# EAGLE schematic RPiOperant (EAGLE 9.1.3)

## Sheet 1 of 2
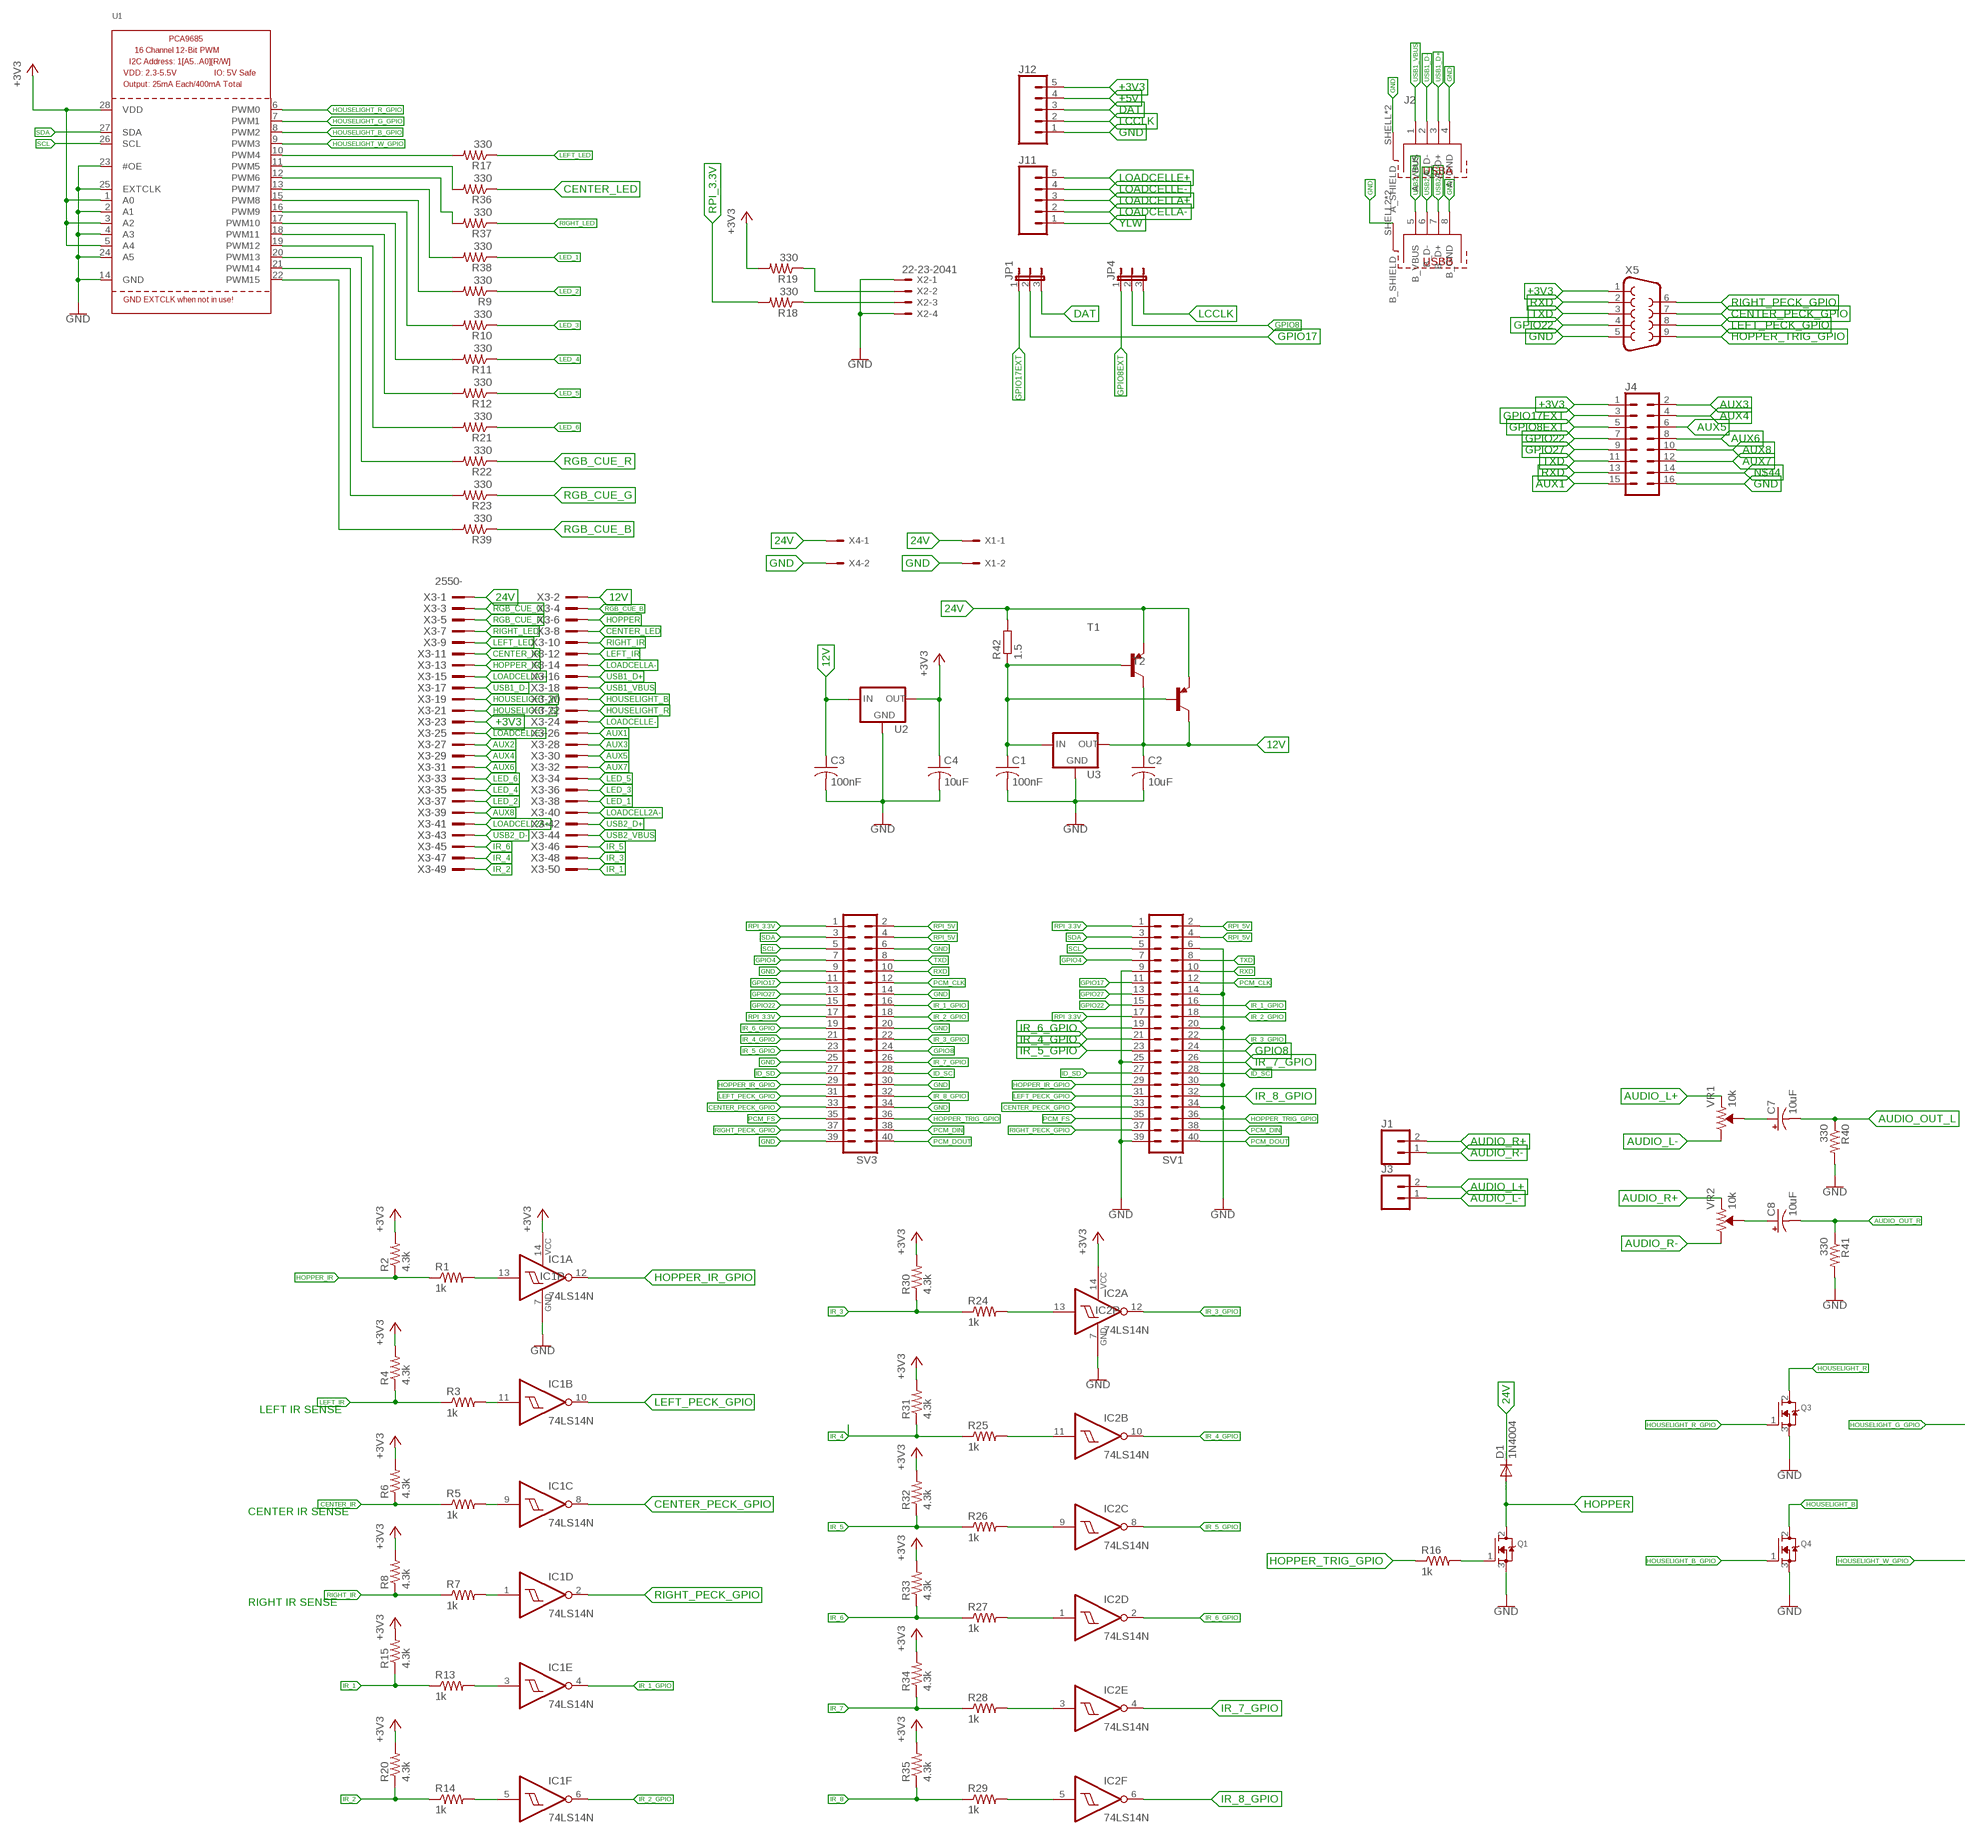
[diagram p0: schematic, sheet 1, part 1 of 2]
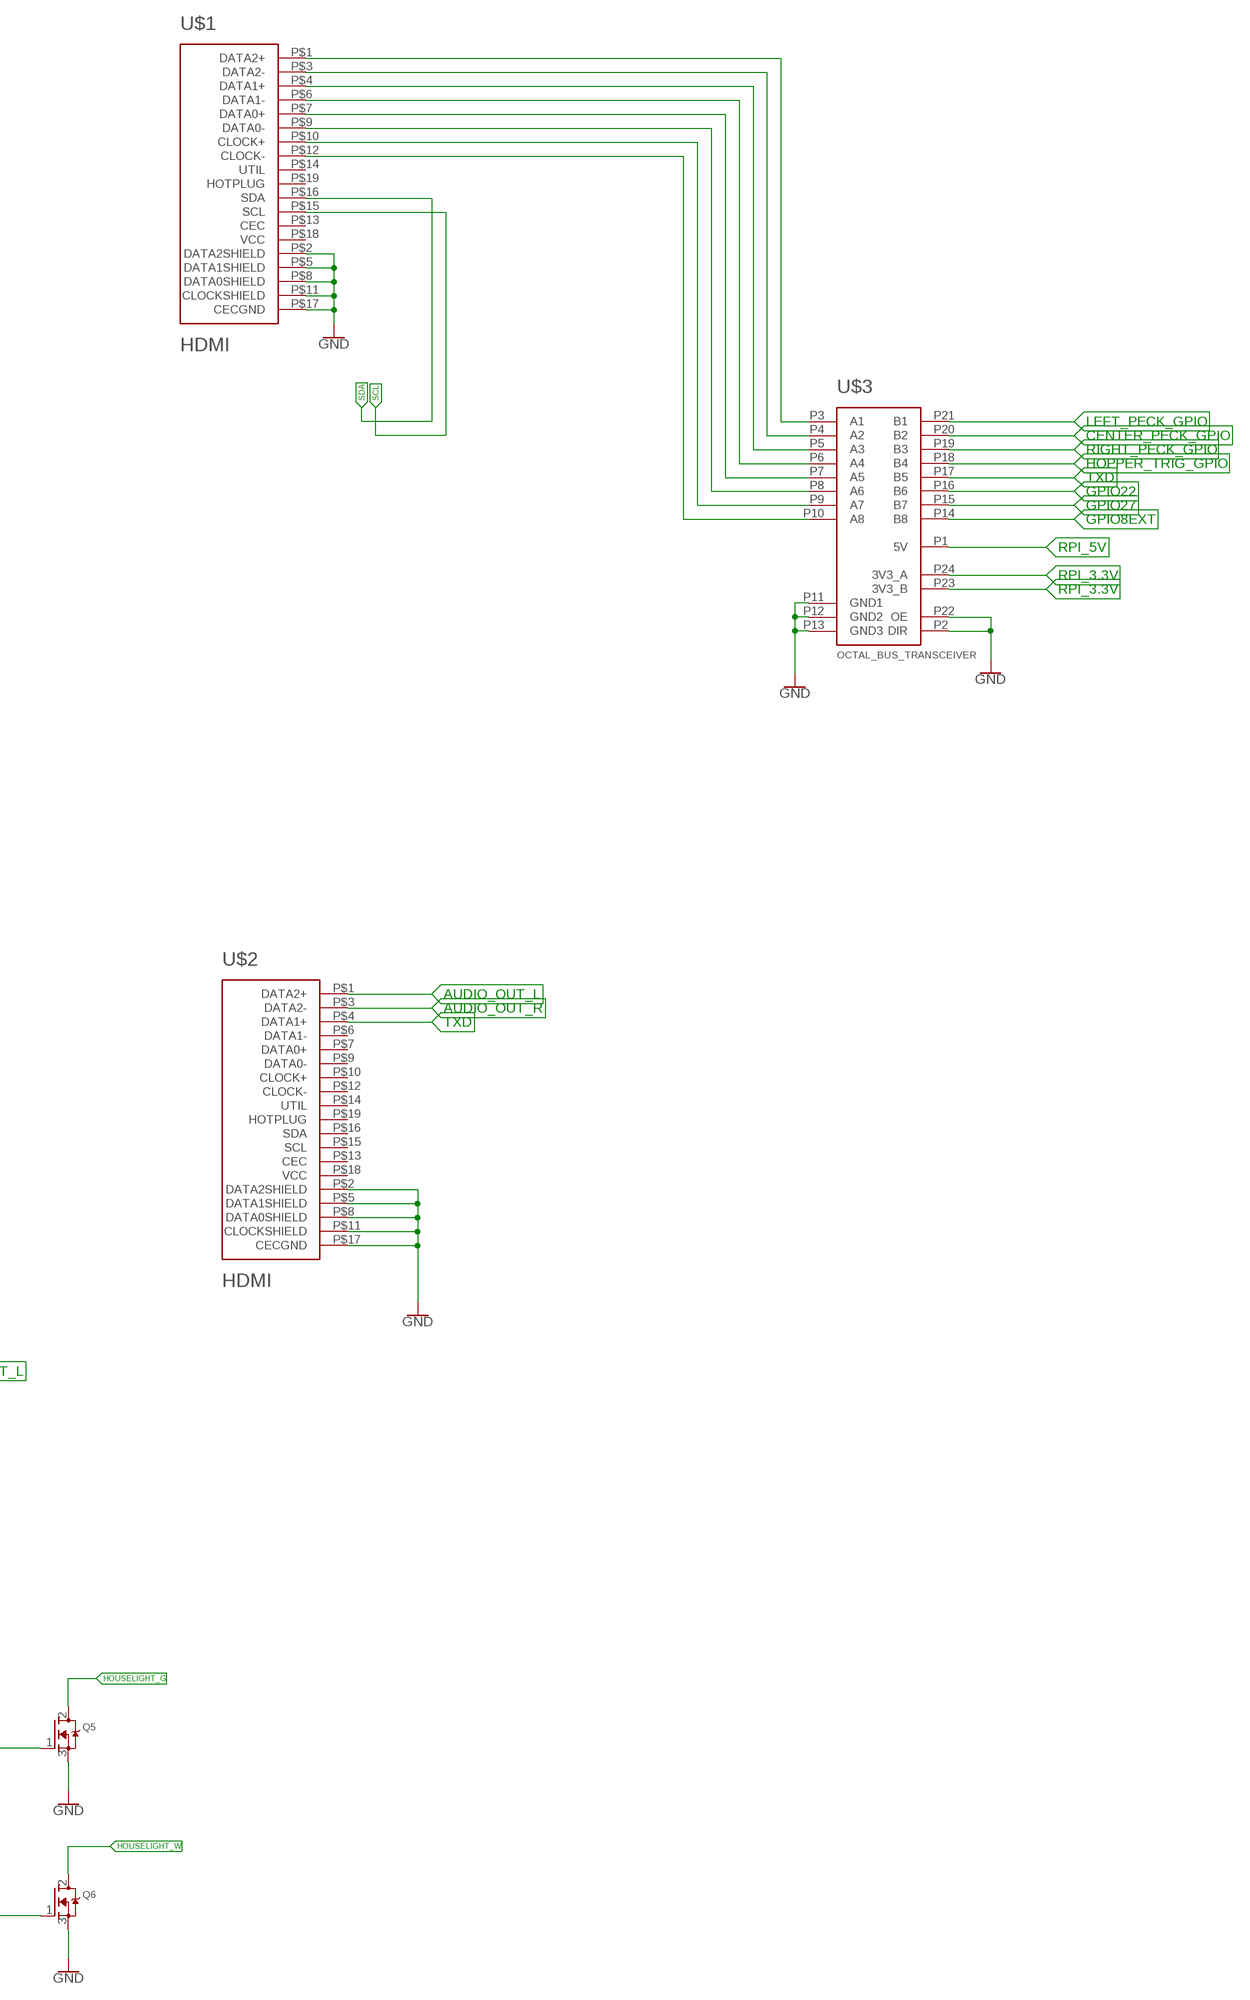
[diagram p1: schematic, sheet 1, part 2 of 2]

### Parts
C1  100nF  C-US050-025X075  [C050-025X075]
C2  10uF  C-US050-025X075  [C050-025X075]
C3  100nF  C-US050-025X075  [C050-025X075]
C4  10uF  C-US050-025X075  [C050-025X075]
C7  10uF  10UF-POLAR-RADIAL-2.5MM-25V-20%  [CPOL-RADIAL-2.5MM-5MM]
C8  10uF  10UF-POLAR-RADIAL-2.5MM-25V-20%  [CPOL-RADIAL-2.5MM-5MM]
D1  1N4004  [DO41-10]
IC1  74LS14N  [DIL14]
IC2  74LS14N  [DIL14]
J1  CONN_02POLAR_LOCK  [MOLEX-1X2_LOCK]
J2  61400826021  [61400826021]
J3  CONN_02POLAR_LOCK  [MOLEX-1X2_LOCK]
J4  CONN_08X2  [2X8]
J11  CONN_05  [1X05]
J12  CONN_05  [1X05]
JP1  JP2E  [JP2]
JP4  JP2E  [JP2]
Q1  MOSFET-NGDS_TO220V  [TO220V]
Q3  MOSFET-NGDS_TO220V  [TO220V]
Q4  MOSFET-NGDS_TO220V  [TO220V]
Q5  MOSFET-NGDS_TO220V  [TO220V]
Q6  MOSFET-NGDS_TO220V  [TO220V]
R1  1k  R-US_0207/7  [0207/7]
R2  4.3k  R-US_0207/7  [0207/7]
R3  1k  R-US_0207/7  [0207/7]
R4  4.3k  R-US_0207/7  [0207/7]
R5  1k  R-US_0207/7  [0207/7]
R6  4.3k  R-US_0207/7  [0207/7]
R7  1k  R-US_0207/7  [0207/7]
R8  4.3k  R-US_0207/7  [0207/7]
R9  330  R-US_0207/7  [0207/7]
R10  330  R-US_0207/7  [0207/7]
R11  330  R-US_0207/7  [0207/7]
R12  330  R-US_0207/7  [0207/7]
R13  1k  R-US_0207/7  [0207/7]
R14  1k  R-US_0207/7  [0207/7]
R15  4.3k  R-US_0207/7  [0207/7]
R16  1k  R-US_0207/7  [0207/7]
R17  330  R-US_0207/7  [0207/7]
R18  330  R-US_0207/7  [0207/7]
R19  330  R-US_0207/7  [0207/7]
R20  4.3k  R-US_0207/7  [0207/7]
R21  330  R-US_0207/7  [0207/7]
R22  330  R-US_0207/7  [0207/7]
R23  330  R-US_0207/7  [0207/7]
R24  1k  R-US_0207/7  [0207/7]
R25  1k  R-US_0207/7  [0207/7]
R26  1k  R-US_0207/7  [0207/7]
R27  1k  R-US_0207/7  [0207/7]
R28  1k  R-US_0207/7  [0207/7]
R29  1k  R-US_0207/7  [0207/7]
R30  4.3k  R-US_0207/7  [0207/7]
R31  4.3k  R-US_0207/7  [0207/7]
R32  4.3k  R-US_0207/7  [0207/7]
R33  4.3k  R-US_0207/7  [0207/7]
R34  4.3k  R-US_0207/7  [0207/7]
R35  4.3k  R-US_0207/7  [0207/7]
R36  330  R-US_0207/7  [0207/7]
R37  330  R-US_0207/7  [0207/7]
R38  330  R-US_0207/7  [0207/7]
R39  330  R-US_0207/7  [0207/7]
R40  330  R-US_0207/7  [0207/7]
R41  330  R-US_0207/7  [0207/7]
R42  1.5  R-EU_0411/15  [0411/15]
SV1  MA20-2  [MA20-2]
SV3  MA20-2  [MA20-2]
T1  -PNP-TO220V  [TO220V]
T2  -PNP-TO220V  [TO220V]
U1  PCA9685  [TSSOP28]
U2  V_REG_78XXSINK  [TO220-IGO]
U3  V_REG_78XXSINK  [TO220-IGO]
U$1  HDMI  [HDMI_A]
U$2  HDMI  [HDMI_A]
U$3  OCTAL_BUS_TRANSCEIVER  [TSSOP-24]
VR1  10k  TRIMPOT-PTH-10MM-KNOB-1/2W-10%  [TRIMPOT-PTH-3386U]
VR2  10k  TRIMPOT-PTH-10MM-KNOB-1/2W-10%  [TRIMPOT-PTH-3386U]
X1  KK-156-2  [KK-156-2]
X2  22-23-2041  [22-23-2041]
X3  2550-  [PAK100/2500-50]
X4  KK-156-2  [KK-156-2]
X5  F09HP  [F09HP]

### Nets
12V [12V]: C2.1 C3.1 T1.2(C) T2.2(C) U2.IN U3.OUT X3.2
24V [12V]: D1.C R42.2 T1.3(E) T2.3(E) X1.1 X3.1 X4.1
+3V3: C4.1 IC1.14(P:VCC) IC2.14(P:VCC) J4.1 J12.5 R2.2 R4.2 R6.2 R8.2 R15.2 R19.2 R20.2 R30.2 R31.2 R32.2 R33.2 R34.2 R35.2 U1.1(A0) U1.3(A2) U1.5(A4) U1.28(VDD) U2.OUT X3.23 X5.1
+5V [5V]: J12.4
AUDIO_L+: J3.2 VR1.1(CCW)
AUDIO_L-: J3.1 VR1.3(CW)
AUDIO_OUT_L: C7.2(-) R40.1 U$2.P$1(DATA2+)
AUDIO_OUT_R: C8.2(-) R41.1 U$2.P$3(DATA2-)
AUDIO_R+: J1.2 VR2.1(CCW)
AUDIO_R-: J1.1 VR2.3(CW)
AUX1: J4.15 X3.26
AUX2: X3.27
AUX3: J4.2 X3.28
AUX4: J4.4 X3.29
AUX5: J4.6 X3.30
AUX6: J4.8 X3.31
AUX7: J4.12 X3.32
AUX8: J4.10 X3.39
CENTER_IR: R5.1 R6.1 X3.11
CENTER_LED: R36.1 X3.8
CENTER_PECK_GPIO: IC1.8(C:O) SV1.33 SV3.33 U$3.P20(B2) X5.7
DAT: J12.3 JP1.3
GND [GND]: C1.2 C2.2 C3.2 C4.2 IC1.7(P:GND) IC2.7(P:GND) J2.4(A_GND) J2.8(B_GND) J2.SHELL1(A_SHIELD) J2.SHELL2(B_SHIELD) J2.SHELL3(B_SHIELD) J2.SHELL(A_SHIELD) J4.16 J12.1 Q1.3(S) Q3.3(S) Q4.3(S) Q5.3(S) Q6.3(S) R40.2 R41.2 SV1.6 SV1.9 SV1.14 SV1.20 SV1.25 SV1.30 SV1.34 SV1.39 SV3.6 SV3.9 SV3.14 SV3.20 SV3.25 SV3.30 SV3.34 SV3.39 U1.2(A1) U1.4(A3) U1.14(GND) U1.23(#OE) U1.24(A5) U1.25(EXTCLK) U2.GND U3.GND U$1.P$2(DATA2SHIELD) U$1.P$5(DATA1SHIELD) U$1.P$8(DATA0SHIELD) U$1.P$11(CLOCKSHIELD) U$1.P$17(CECGND) U$2.P$2(DATA2SHIELD) U$2.P$5(DATA1SHIELD) U$2.P$8(DATA0SHIELD) U$2.P$11(CLOCKSHIELD) U$2.P$17(CECGND) U$3.P2(DIR) U$3.P11(GND1) U$3.P12(GND2) U$3.P13(GND3) U$3.P22(OE) X1.2 X2.1 X2.4 X4.2 X5.5
GPIO4: SV1.7 SV3.7
GPIO8: JP4.2 SV1.24 SV3.24
GPIO8EXT: J4.5 JP4.1 U$3.P14(B8)
GPIO17: JP1.2 SV1.11 SV3.11
GPIO17EXT: J4.3 JP1.1
GPIO22: J4.7 SV1.15 SV3.15 U$3.P16(B6) X5.4
GPIO27: J4.9 SV1.13 SV3.13 U$3.P15(B7)
HOPPER: D1.A Q1.2(D) X3.6
HOPPER_IR: R1.1 R2.1 X3.13
HOPPER_IR_GPIO: IC1.12(A:O) SV1.29 SV3.29
HOPPER_TRIG_GPIO: R16.1 SV1.36 SV3.36 U$3.P18(B4) X5.9
HOUSELIGHT_B: Q4.2(D) X3.20
HOUSELIGHT_B_GPIO: Q4.1(G) U1.8(PWM2)
HOUSELIGHT_G: Q5.2(D) X3.21
HOUSELIGHT_G_GPIO: Q5.1(G) U1.7(PWM1)
HOUSELIGHT_R: Q3.2(D) X3.22
HOUSELIGHT_R_GPIO: Q3.1(G) U1.6(PWM0)
HOUSELIGHT_W: Q6.2(D) X3.19
HOUSELIGHT_W_GPIO: Q6.1(G) U1.9(PWM3)
ID_SC: SV1.28 SV3.28
ID_SD: SV1.27 SV3.27
IR_1: R13.1 R15.1 X3.50
IR_1_GPIO: IC1.4(E:O) SV1.16 SV3.16
IR_2: R14.1 R20.1 X3.49
IR_2_GPIO: IC1.6(F:O) SV1.18 SV3.18
IR_3: R24.1 R30.1 X3.48
IR_3_GPIO: IC2.12(A:O) SV1.22 SV3.22
IR_4: R25.1 R31.1 X3.47
IR_4_GPIO: IC2.10(B:O) SV1.21 SV3.21
IR_5: R26.1 R32.1 X3.46
IR_5_GPIO: IC2.8(C:O) SV1.23 SV3.23
IR_6: R27.1 R33.1 X3.45
IR_6_GPIO: IC2.2(D:O) SV1.19 SV3.19
IR_7: R28.1 R34.1
IR_7_GPIO: IC2.4(E:O) SV1.26 SV3.26
IR_8: R29.1 R35.1
IR_8_GPIO: IC2.6(F:O) SV1.32 SV3.32
LCCLK: J12.2 JP4.3
LED_1: R38.1 X3.38
LED_2: R9.1 X3.37
LED_3: R10.1 X3.36
LED_4: R11.1 X3.35
LED_5: R12.1 X3.34
LED_6: R21.1 X3.33
LEFT_IR: R3.1 R4.1 X3.12
LEFT_LED: R17.1 X3.9
LEFT_PECK_GPIO: IC1.10(B:O) SV1.31 SV3.31 U$3.P21(B1) X5.8
LOADCELL2A+: X3.41
LOADCELL2A-: X3.40
LOADCELLA+: J11.3 X3.15
LOADCELLA-: J11.2 X3.14
LOADCELLE+: J11.5 X3.25
LOADCELLE-: J11.4 X3.24
N$1: IC1.3(E:I) R13.2
N$2: IC1.5(F:I) R14.2
N$3: IC2.13(A:I) R24.2
N$4: IC2.11(B:I) R25.2
N$5: IC2.9(C:I) R26.2
N$6: IC1.13(A:I) R1.2
N$7: IC2.1(D:I) R27.2
N$8: IC1.11(B:I) R3.2
N$9: IC2.3(E:I) R28.2
N$10: IC1.9(C:I) R5.2
N$11: IC2.5(F:I) R29.2
N$12: IC1.1(D:I) R7.2
N$13: R17.2 U1.10(PWM4)
N$14: R36.2 U1.11(PWM5)
N$15: R37.2 U1.12(PWM6)
N$16: R38.2 U1.13(PWM7)
N$17: U$1.P$1(DATA2+) U$3.P3(A1)
N$18: U$1.P$3(DATA2-) U$3.P4(A2)
N$19: R22.2 U1.20(PWM13)
N$20: R23.2 U1.21(PWM14)
N$21: R39.2 U1.22(PWM15)
N$22: C1.1 R42.1 T1.1(B) T2.1(B) U3.IN
N$24: Q1.1(G) R16.2
N$25: R19.1 X2.2
N$26: R9.2 U1.15(PWM8)
N$27: R10.2 U1.16(PWM9)
N$28: R11.2 U1.17(PWM10)
N$29: R12.2 U1.18(PWM11)
N$30: R21.2 U1.19(PWM12)
N$31: R18.1 X2.3
N$32: U$1.P$4(DATA1+) U$3.P5(A3)
N$33: U$1.P$6(DATA1-) U$3.P6(A4)
N$34: C7.1(+) VR1.2(WIPER)
N$35: C8.1(+) VR2.2(WIPER)
N$36: U$1.P$7(DATA0+) U$3.P7(A5)
N$37: U$1.P$9(DATA0-) U$3.P8(A6)
N$38: U$1.P$10(CLOCK+) U$3.P9(A7)
N$39: U$1.P$12(CLOCK-) U$3.P10(A8)
N$44: J4.14
PCM_CLK: SV1.12 SV3.12
PCM_DIN: SV1.38 SV3.38
PCM_DOUT: SV1.40 SV3.40
PCM_FS: SV1.35 SV3.35
RGB_CUE_B: R39.1 X3.4
RGB_CUE_G: R23.1 X3.3
RGB_CUE_R: R22.1 X3.5
RIGHT_IR: R7.1 R8.1 X3.10
RIGHT_LED: R37.1 X3.7
RIGHT_PECK_GPIO: IC1.2(D:O) SV1.37 SV3.37 U$3.P19(B3) X5.6
RPI_3.3V: R18.2 SV1.1 SV1.17 SV3.1 SV3.17 U$3.P23(3V3_B) U$3.P24(3V3_A)
RPI_5V: SV1.2 SV1.4 SV3.2 SV3.4 U$3.P1(5V)
RXD: J4.13 SV1.10 SV3.10 X5.2
SCL: SV1.5 SV3.5 U1.26(SCL) U$1.P$15(SCL)
SDA: SV1.3 SV3.3 U1.27(SDA) U$1.P$16(SDA)
TXD: J4.11 SV1.8 SV3.8 U$2.P$4(DATA1+) U$3.P17(B5) X5.3
USB1_D+: J2.3(A_D+) X3.16
USB1_D-: J2.2(A_D-) X3.17
USB1_VBUS: J2.1(A_VBUS) X3.18
USB2_D+: J2.7(B_D+) X3.42
USB2_D-: J2.6(B_D-) X3.43
USB2_VBUS: J2.5(B_VBUS) X3.44
YLW: J11.1
Unconnected: U$1.P$13(CEC) U$1.P$14(UTIL) U$1.P$18(VCC) U$1.P$19(HOTPLUG) U$2.P$6(DATA1-) U$2.P$7(DATA0+) U$2.P$9(DATA0-) U$2.P$10(CLOCK+) U$2.P$12(CLOCK-) U$2.P$13(CEC) U$2.P$14(UTIL) U$2.P$15(SCL) U$2.P$16(SDA) U$2.P$18(VCC) U$2.P$19(HOTPLUG)

### Notes on the sheet
- LEFT IR SENSE
- CENTER IR SENSE
- RIGHT IR SENSE

## Sheet 2 of 2
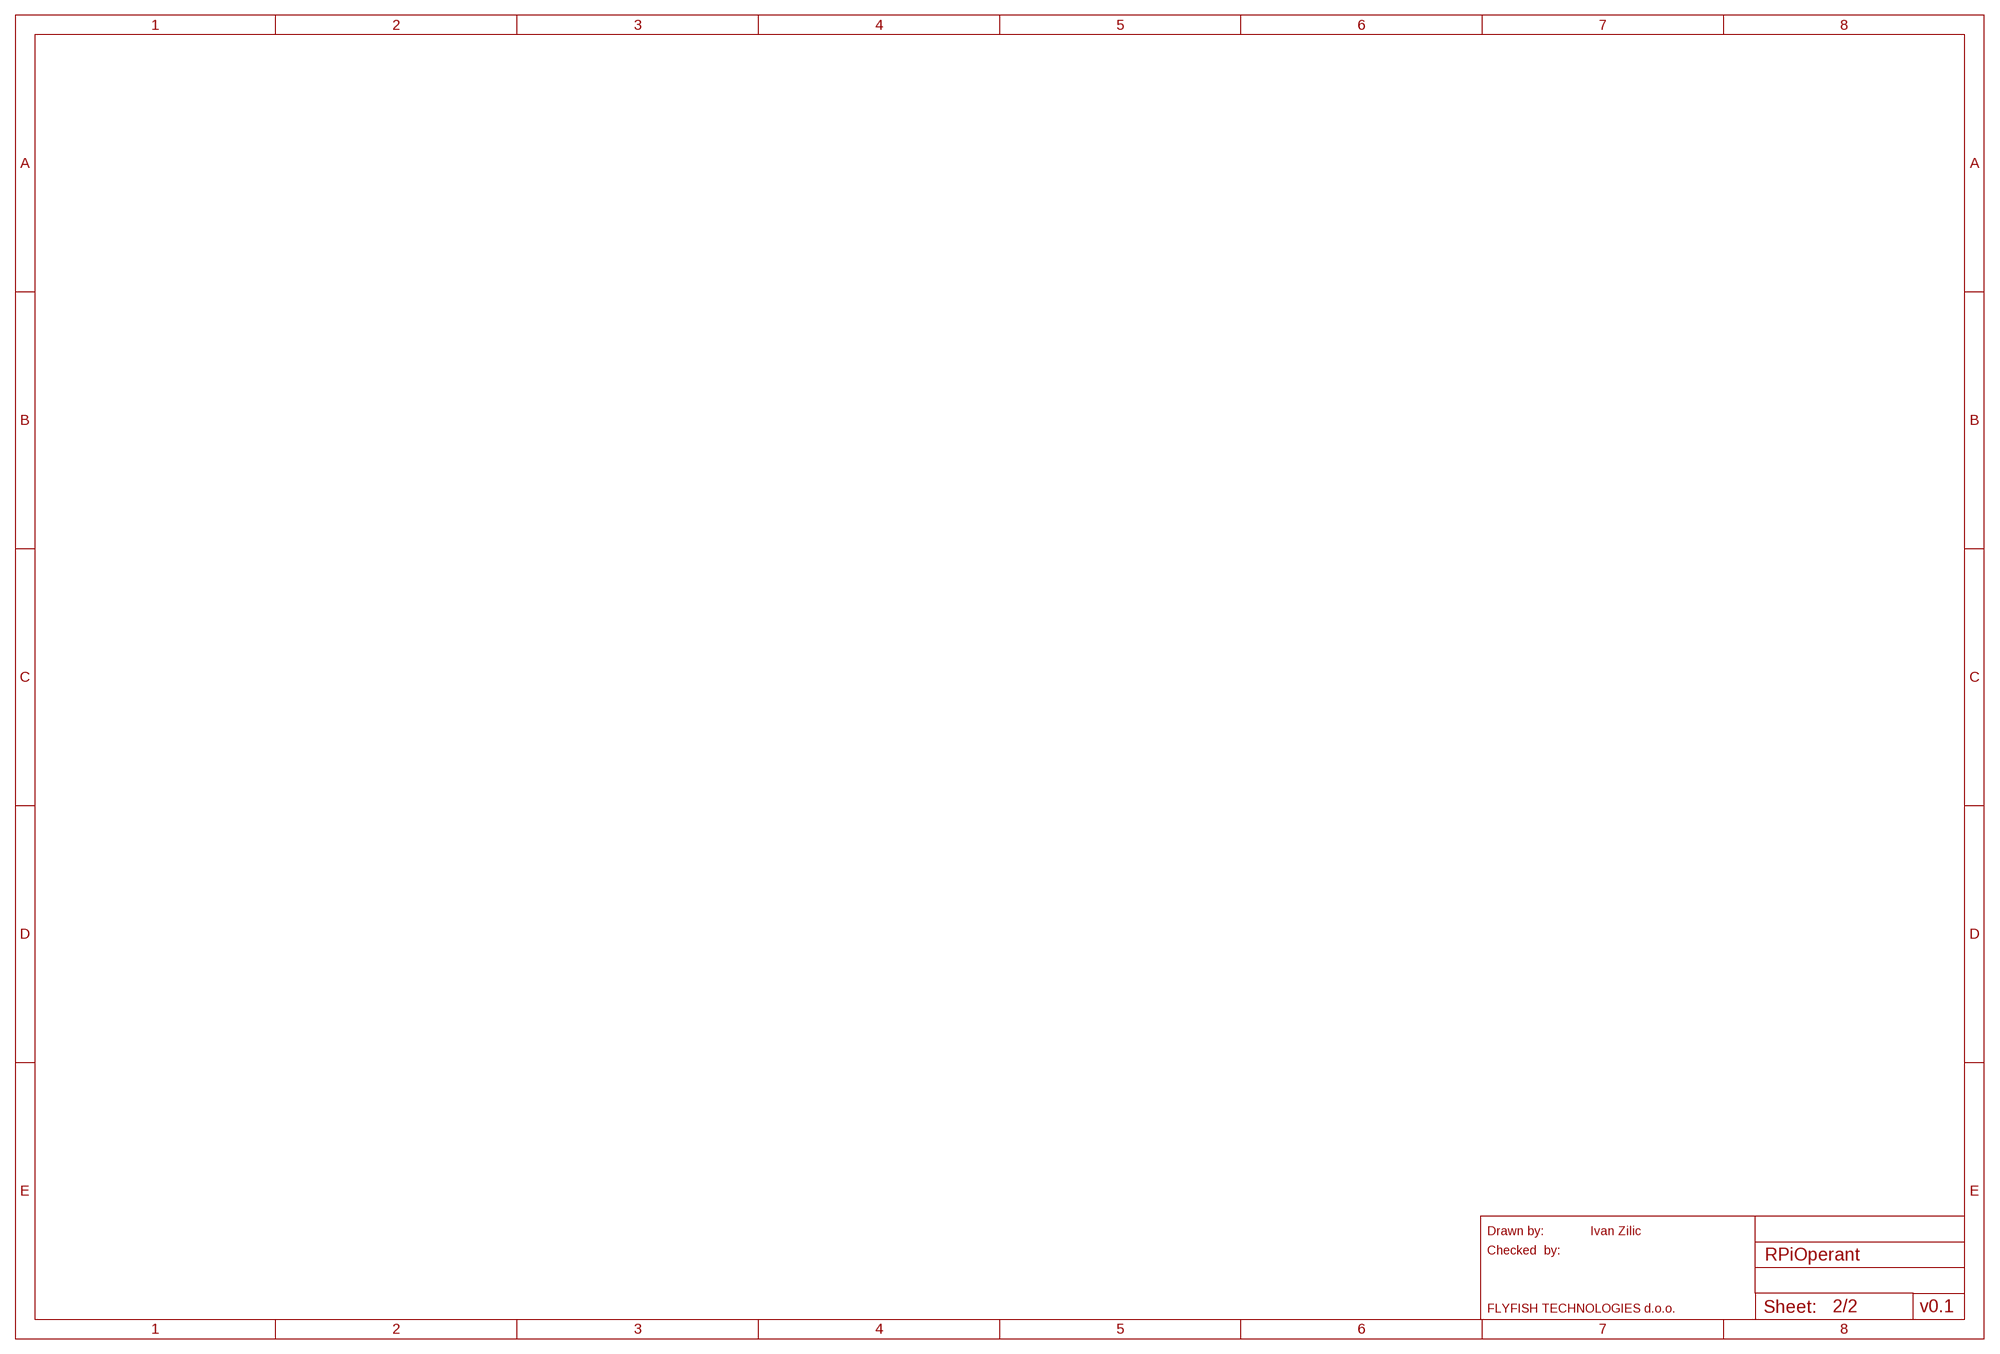
[diagram p2: schematic, sheet 2]

### Notes on the sheet
- Drawn by: | Ivan Zilic
- Checked  by:
- FLYFISH TECHNOLOGIES d.o.o. | v0.1

## Library data of the parts
C1-C4 = adafruit:C-US: CAPACITOR, American symbol
C7 C8 = SparkFun-Capacitors:10UF-POLAR: 10.0µF polarized capacitors A capacitor is a passive two-terminal electrical component used to store electrical energy temporarily in an electric field.; PROD_ID: CAP-08440
D1 = diode:1N4004: DIODE general purpose rectifier, 1 A
IC1 = 74xx-us:74*14: Hex schmitt trigger INVERTER; SPICEPREFIX: I
IC2 = 74xx-us:74*14: Hex schmitt trigger INVERTER
J1 J3 = SparkFun-Connectors:CONN_02: Multi connection point. Often used as Generic Header-pin footprint for 0.1 inch spaced/style header connections On any of the 0.1 inch spaced packages, you can populate with these: Break Away Headers - Straight <https://www.sparkfun.com/products/116> (PRT-00116) Break Away Male Headers - Right Angle <https://www.sparkfun.com/products/553> (PRT-00553) Female Headers <https://www.sparkfun.com/products/115> (PRT-00115) Break Away Headers - Machine Pin <https://www.sparkfun.com/products/117> (PRT-00117) Break Away Female Headers - Swiss Machine Pin <https://www.sparkfun.com/products/743> (PRT-00743) For SCREWTERMINALS and SPRING TERMINALS visit here: Screw Terimnals on SparkFun.com <https://www.sparkfun.com/search/results?term=Screw+Terminals> (5mm/3.5mm/2.54mm spacing) This device is also useful as a general connection point to wire up your design to another part of your project. Our various solder wires solder well into these plated through hole pads. Hook-Up Wire - Assortment (Stranded, 22 AWG) <https://www.sparkfun.com/products/11375> (PRT-11375) Hook-Up Wire - Assortment (Solid Core, 22 AWG) <https://www.sparkfun.com/products/11367> (PRT-11367) View the entire wire category on our website here <https://www.sparkfun.com/categories/141> Special notes: Molex polarized connector foot print use with: PRT-08233 with associated crimp pins and housings. 2.54_SCREWTERM for use with PRT-10571. 3.5mm Screw Terminal footprints for PRT-08084 5mm Screw Terminal footprints for use with PRT-08432; SF_ID: PRT-09918
J2 = InputOutputIO (rev18a):61400826021: WR-COM Horizontal Dual Stacked USB Type A=>Code : Con_I-O_COM_USB-2.0_A_61400826021 <http://katalog.we-online.de/media/images/eican/Con_I-O_COM_USB-2.0_A_61400826021_pf2.jpg> Details see: http://katalog.we-online.de/en/em/614_008_260_21 Created 2014-07-09, Karrer Zheng 2014 (C) Würth Elektronik
J4 = SparkFun-Connectors:CONN_08X2: Multi connection point. Often used as Generic Header-pin footprint for 0.1 inch spaced/style header connections You can populate with any combo of single row headers, but if you'd like an exact match, check this: Header - 2x8 (Male, 0.1") <https://www.sparkfun.com/products/13156> (PRT-13156) On any of the 0.1 inch spaced packages, you can populate with these: Break Away Headers - Straight <https://www.sparkfun.com/products/116> (PRT-00116) Break Away Male Headers - Right Angle <https://www.sparkfun.com/products/553> (PRT-00553) Female Headers <https://www.sparkfun.com/products/115> (PRT-00115) Break Away Headers - Machine Pin <https://www.sparkfun.com/products/117> (PRT-00117) Break Away Female Headers - Swiss Machine Pin <https://www.sparkfun.com/products/743> (PRT-00743)
J11 J12 = SparkFun-Connectors:CONN_05: Multi connection point. Often used as Generic Header-pin footprint for 0.1 inch spaced/style header connections On any of the 0.1 inch spaced packages, you can populate with these: Break Away Headers - Straight <https://www.sparkfun.com/products/116> (PRT-00116) Break Away Male Headers - Right Angle <https://www.sparkfun.com/products/553> (PRT-00553) Female Headers <https://www.sparkfun.com/products/115> (PRT-00115) Break Away Headers - Machine Pin <https://www.sparkfun.com/products/117> (PRT-00117) Break Away Female Headers - Swiss Machine Pin <https://www.sparkfun.com/products/743> (PRT-00743) For SCREWTERMINALS and SPRING TERMINALS visit here: Screw Terimnals on SparkFun.com <https://www.sparkfun.com/search/results?term=Screw+Terminals> (5mm/3.5mm/2.54mm spacing) This device is also useful as a general connection point to wire up your design to another part of your project. Our various solder wires solder well into these plated through hole pads. Hook-Up Wire - Assortment (Stranded, 22 AWG) <https://www.sparkfun.com/products/11375> (PRT-11375) Hook-Up Wire - Assortment (Solid Core, 22 AWG) <https://www.sparkfun.com/products/11367> (PRT-11367) View the entire wire category on our website here <https://www.sparkfun.com/categories/141> Special notes: Molex polarized connector foot print use with SKU : PRT-08231 with associated crimp pins and housings. 1MM SMD Version SKU: PRT-10208
JP1 JP4 = jumper:JP2E: JUMPER
Q1 Q3-Q6 = adafruit:MOSFET-N: N-Channel Mosfet 2N7002E - 60V 260mA SOT23 [Digikey: 2N7002ET1GOSTR-ND] - REEL BSH103 - 30V 850mA SOT23 [Digikey: 568-5013-1-ND]
R1 R2 R5-R41 = resistor:R-US_: RESISTOR, American symbol
R3 R4 = resistor:R-US_: RESISTOR, American symbol; SPICEPREFIX: R
R42 = resistor:R-EU_: RESISTOR, European symbol
SV1 SV3 = con-lstb:MA20-2: PIN HEADER; OC_FARNELL: unknown; OC_NEWARK: unknown
T1 T2 = transistor:*-PNP-: PNP Transistror
U1 = adafruit:PCA9685: PCA9685 - 16 Channel 12-Bit I2C PWM Controller 5.0V tolerant 16 channel, 12-bit I2C PWM controller with 25mA per output (max. 400mA total) Digikey: 568-5931-1-ND
U2 U3 = SparkFun-IC-Power:V_REG_78XX: Voltage Regulator Standard 78xx regulator. IGO (Input Ground Output). Spark Fun Electronics SKU : COM-00107
U$1 U$2 = open-ephys:HDMI: Horizonal HDMI type "A" jack
U$3 = open-ephys:OCTAL_BUS_TRANSCEIVER: Texas Instruments 8-bit, dual-supply bus transceiver
VR1 VR2 = SparkFun-Resistors:TRIMPOT: Trimming Potentiometer (Trimpot) Three-terminal potentiometers, with an adjustable wiper and two adjustable resistors. A pot can be used to create a configurable voltage divider, or as a variable resistor. "Trimpots" are a subset of potentiometers, usually intended for "set-and-forget" applications. They're often more delicate than standard potentiometers - rated for fewer turns. Variants PTH-KNOB - PTH Trimpot w/ finger-adjustable knob Trimpot 10K with Knob <https://www.sparkfun.com/products/9806> (COM-09806) Datasheet <http://www.sparkfun.com/datasheets/Components/General/TSR-3386.pdf> SMD-3MM-CLOSED-FRAME - SMD 3mm Square Closed-Frame Trimpot Used on e.g. EasyDriver - Stepper Motor Driver <https://www.sparkfun.com/products/12779> Datasheet <http://www.bitechnologies.com/pdfs/22.pdf> (22AR10KTR) SMD-5MM - SMD 5mm Square Closed-Frame Trimpot Used on e.g. IOIO-OTG - V2.2 <https://www.sparkfun.com/products/13613> Datasheet <http://www.vishay.com/docs/51008/ts53.pdf> (TS53YL502MR10) SMD-3MM-1/10W-25% - 3mm Square Open-Frame Trimpot Used on e.g. SparkFun Shapeoko <https://www.sparkfun.com/products/13899> Datasheet <http://www.bourns.com/docs/Product-Datasheets/TC33.pdf> (TC33X-2-103E); PROD_ID: RES-09730; SF_SKU: COM-09806
X1 X4 = con-molex:KK-156-2: KK 156 HEADER Source: http://www.molex.com/pdm_docs/sd/026604100_sd.pdf; MF: MOLEX; OC_FARNELL: unknown; OC_NEWARK: unknown
X2 = con-molex:22-23-2041: .100" (2.54mm) Center Header - 4 Pin; MF: MOLEX; MPN: 22-23-2041; OC_FARNELL: 1462920; OC_NEWARK: 38C0355
X3 = con-3m:2550-: 3M (TM) Pak 100 4-Wall Header Source: 3M; OC_FARNELL: unknown; OC_NEWARK: unknown
X5 = con-subd:F09: SUB-D; OC_FARNELL: unknown; OC_NEWARK: unknown

## Net classes
0 default: width 0.152 mm
1 12V: width 1.372 mm, clearance 0.254 mm
2 5V: width 0.508 mm
3 GND: width 0.203 mm
4 24V: width 1.372 mm